# EAGLE design Xmas tree (EAGLE 9.6.2)
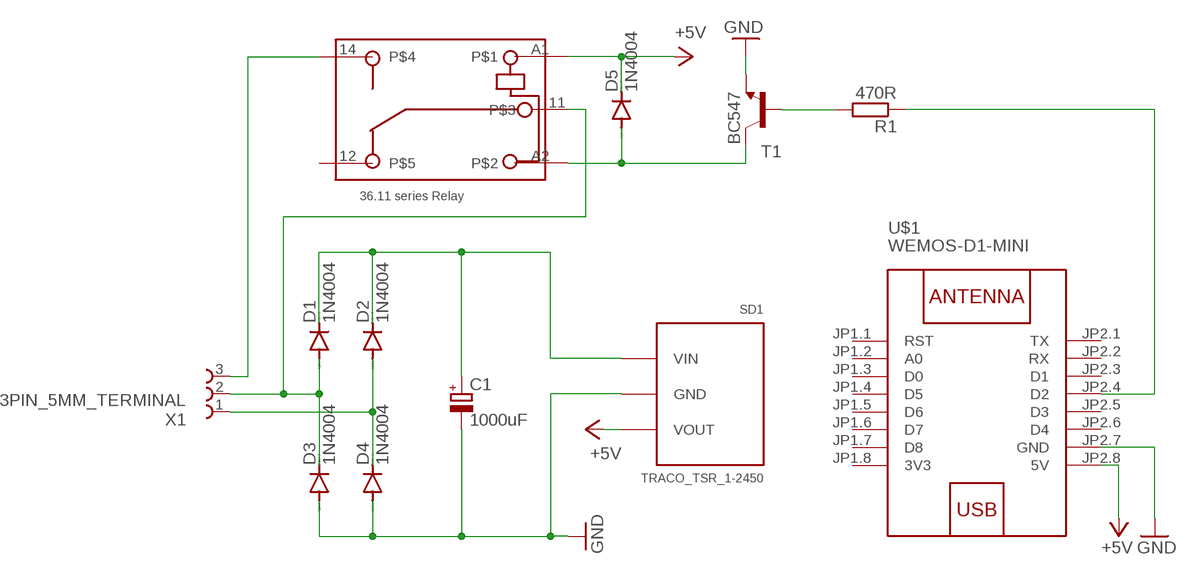
[diagram p0: schematic, sheet 1]

## Parts
C1  1000uF  CPOL-EUE3.5-10  [E3,5-10]
D1  1N4004  [DO41-10]
D2  1N4004  [DO41-10]
D3  1N4004  [DO41-10]
D4  1N4004  [DO41-10]
D5  1N4004  [DO41-10]
R1  470R  R-EU_0207/10  [0207/10]
RL1  36.11  [36.11]
SD1  TRACO_TSR_1-2450  [TRACO_TSR_1-2450]
T1  BC547  BC547-NPN-TO92-CBE  [TO92-CBE]
U$1  WEMOS-D1-MINI  [WEMOS-D1-MINI]
X1  3PIN_5MM_TERMINAL  [3PIN_5MM_TERMINAL]

## Nets
12VDC: C1.+ D1.C D2.C SD1.VIN
+5V: D5.C RL1.A1 SD1.VOUT U$1.JP2.8(5V)
+12VAC: D1.A D3.C RL1.11 X1.2
-12VAC: D2.A D4.C X1.1
GND: C1.- D3.A D4.A SD1.GND T1.E U$1.JP2.7(GND)
N$4: R1.2 T1.B
N$5: D5.A RL1.A2 T1.C
N$6: R1.1 U$1.JP2.4(D2)
OUTPUT: RL1.14 X1.3
Unconnected: RL1.12 U$1.JP1.1(RST) U$1.JP1.2(A0) U$1.JP1.3(D0) U$1.JP1.4(D5) U$1.JP1.5(D6) U$1.JP1.6(D7) U$1.JP1.7(D8) U$1.JP2.1(TX) U$1.JP2.2(RX) U$1.JP2.3(D1) U$1.JP2.5(D3) U$1.JP2.6(D4)

## Power pins joined to a net without a drawn wire
3V3: U$1.JP1.8(3V3)

## Library data of the parts
C1 = resistor:CPOL-EU: POLARIZED CAPACITOR, European symbol
D1-D5 = diode:1N4004: DIODE general purpose rectifier, 1 A
R1 = resistor:R-EU_: RESISTOR, European symbol
RL1 = Rele_Finder:36.11: Printed circuit mount miniature 10 A relay one pole changeover contacts Conform RoHS
SD1 = Voltage:TRACO_TSR_1-2450
T1 = transistor:*-NPN-: NPN Transistror BF959 corrected 2008.03.06
U$1 = Sbirka modulu:WEMOS-D1-MINI: WEMOS D1 mini: Mini Wi-Fi Board based on ESP-8266 device More details can be found here: https://www.wemos.cc/product/d1-mini.html Click here to find device on ebay.com <http://www.ebay.com/sch/wemos+d1+mini+nodemcu>
X1 = Terminaly:3PIN_5MM_TERMINAL

## Board
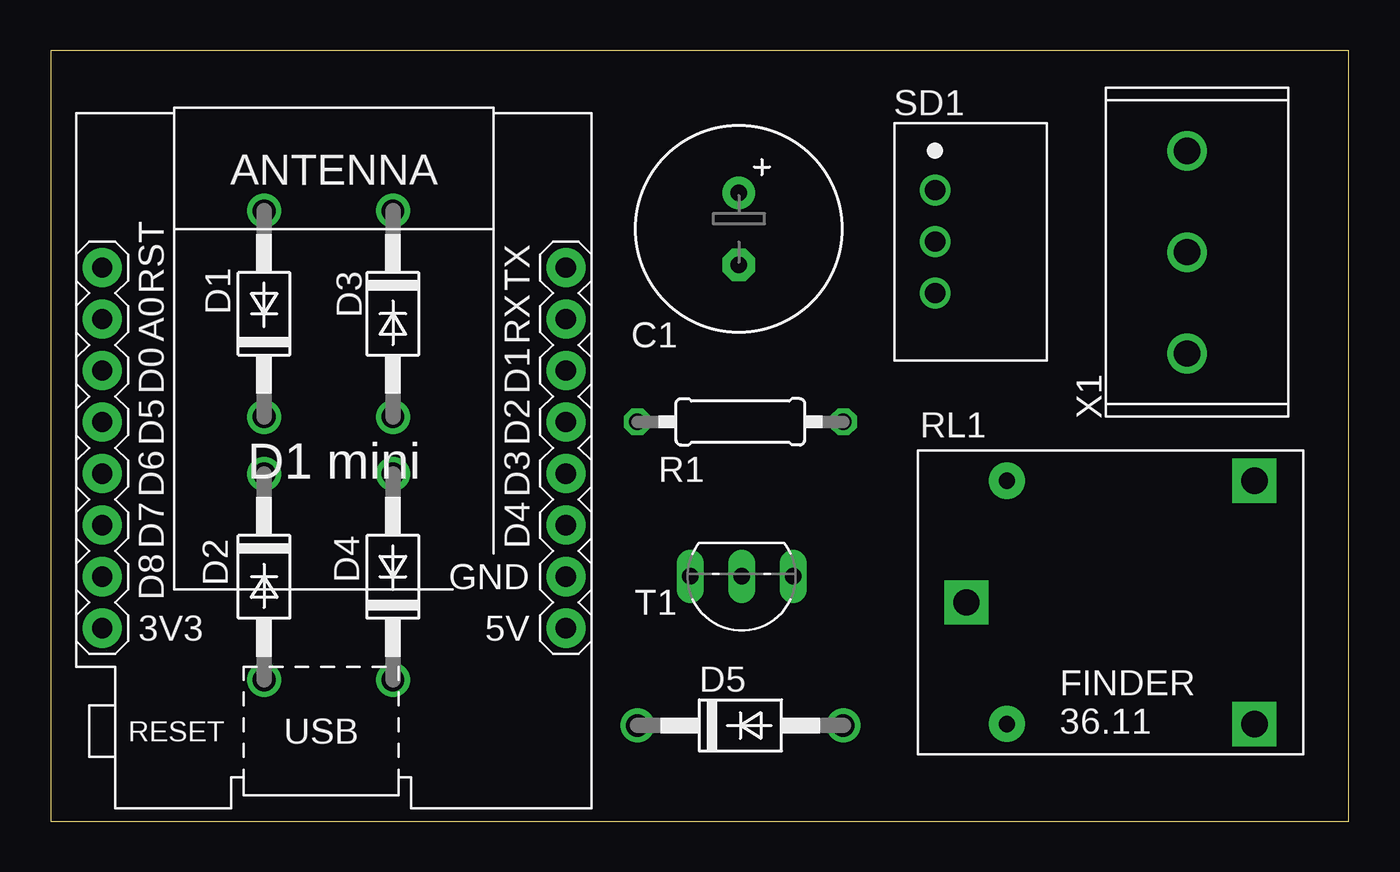
[diagram p1: board, top side]
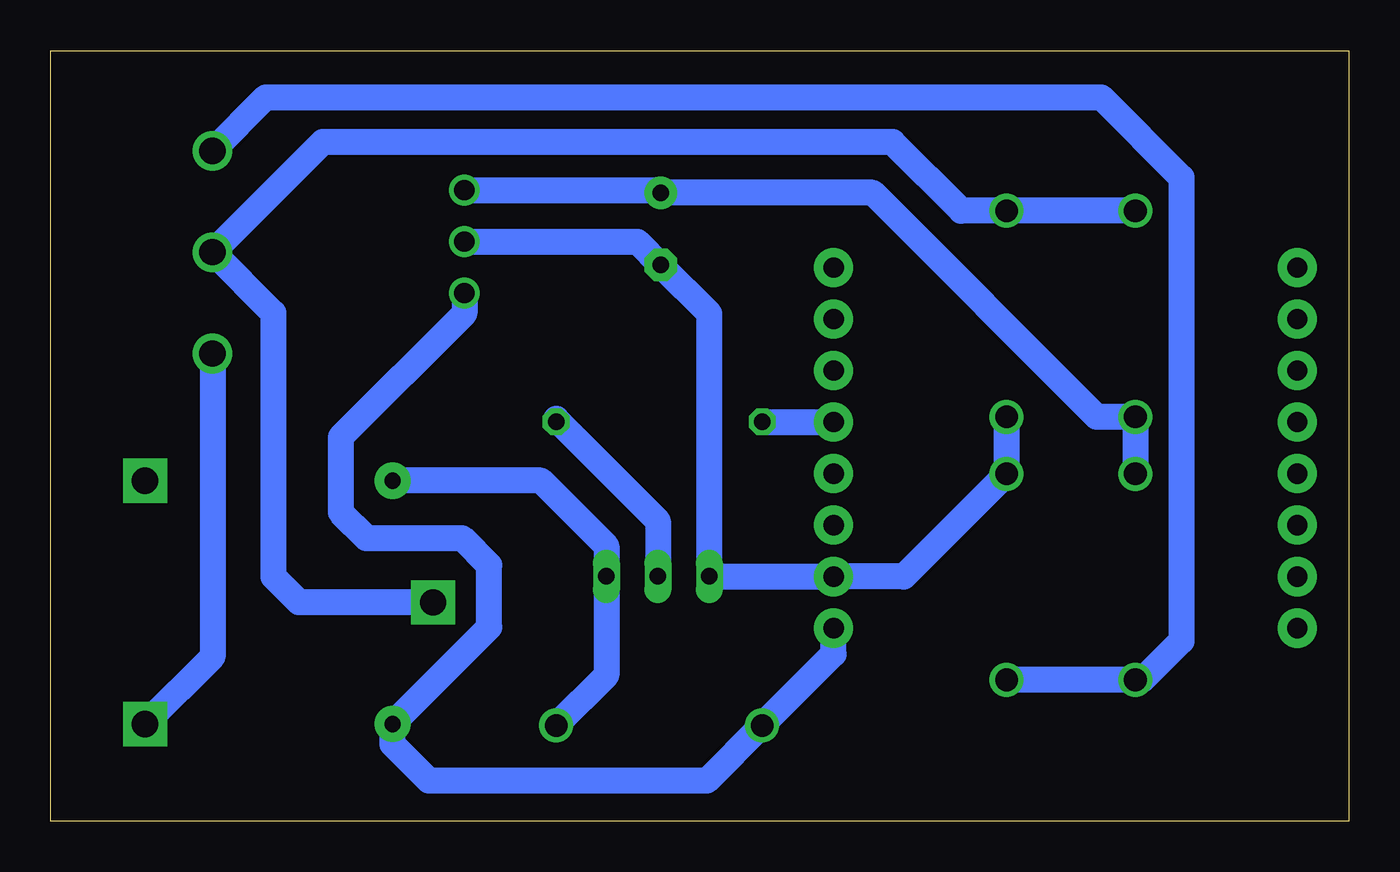
[diagram p2: board, bottom side, seen from below]

Size 64 x 38 mm. Coordinates in mm from the lower left corner, seen from the top.
Outline: 0,0 64,0 64,38 0,38 0,0
Copper layers (1*16): Top 0.035mm / dielectric 1.5mm / Bottom 0.035mm
Design rules "default": minimum track width 6mil, minimum drill 0.35mm, track to track 6mil, track to pad 6mil, pad to pad 6mil, via to via 6mil, smd to smd 6mil, copper to edge 40mil, drill to drill 6mil, minimum pad ring 10mil, minimum via ring 8mil, stop-mask expansion 4mil, vias tented up to drill 0mil, thermal gap 10mil

### Footprints (pad centres in the part's own frame; a part is rotated, then mirrored left to right if it is on the bottom)
E3,5-10 = drill 0.813 pad 1.6: + -1.778,0 | drill 0.813 pad 1.6 octagon: - 1.778,0
DO41-10 = drill 1.118: A 5.08,0; C -5.08,0
0207/10 = drill 0.813 octagon: 1 -5.08,0; 2 5.08,0
36.11 = drill 1.3 pad 2.184 square: 11 -7.1,0; 12 7.1,6; 14 7.1,-6 | drill 0.8 pad 1.778: A1 -5.1,-6; A2 -5.1,6
TRACO_TSR_1-2450 = drill 1: GND -0.01,-1.75; VIN -2.55,-1.75; VOUT 2.53,-1.75
TO92-CBE = drill 0.813 long: B 0,0; C -2.54,0; E 2.54,0
WEMOS-D1-MINI = drill 1 pad 1.93: JP1.1 -11.43,9.525; JP1.2 -11.43,6.985; JP1.3 -11.43,4.445; JP1.4 -11.43,1.905; JP1.5 -11.43,-0.635; JP1.6 -11.43,-3.175; JP1.7 -11.43,-5.715; JP1.8 -11.43,-8.255; JP2.1 11.43,9.525; JP2.2 11.43,6.985; JP2.3 11.43,4.445; JP2.4 11.43,1.905; JP2.5 11.43,-0.635; JP2.6 11.43,-3.175; JP2.7 11.43,-5.715; JP2.8 11.43,-8.255
3PIN_5MM_TERMINAL = drill 1.3: 1 -5,0; 2 0,0; 3 5,0

### Placement (x,y rotation side)
C1  33.92,29.21 270 top
D1  10.52,25.02 90 top
D2  10.52,12.05 270 top
D3  16.87,25.02 270 top
D4  16.87,12.05 90 top
D5  34,4.72 0 top
R1  34,19.7 0 top
RL1  52.24,10.79 0 top
SD1  45.35,28.57 270 top
T1  34.06,12.07 180 top
U$1  13.97,17.78 0 top
X1  56.02,28.07 270 top

### Tracks (layer width: path | path; a pad name or v marks a point on that pad's centre or on a via)
12VDC
  Bottom 1.27: D2.C D1.C 12.43,19.95 23.47,30.99 C1.+ 34.06,31.12 SD1.VIN
+5V
  Bottom 1.27: SD1.VOUT 43.6,25.05 49.7,18.95 49.7,15.24 48.44,13.97 43.72,13.97 42.38,12.62 42.38,9.56 RL1.A1 47.15,3.79 45.35,2 31.64,2 D5.C 25.4,8.24 U$1.JP2.8
+12VAC
  Bottom 1.27: RL1.11 51.76,10.79 53.02,12.06 53.02,25.07 X1.2 50.59,33.5 22.5,33.5 19.11,30.11 D3.C D1.A
-12VAC
  Bottom 1.27: D4.C D2.A 10.17,6.97 8.26,8.89 8.26,31.75 12.2,35.7 53.4,35.7 X1.1
GND
  Bottom 1.27: D3.A D4.A 21.94,12.06 U$1.JP2.7 T1.E 31.52,25.03 C1.- 35.08,28.59 SD1.GND
N$4
  Bottom 1.27: R1.2 39.08,19.84 34.06,14.8 T1.B
N$5
  Bottom 1.27: D5.A 36.6,7.2 36.6,13.57 39.83,16.8 RL1.A2
N$6
  Bottom 0.152: U$1.JP2.4 25.5,19.68 25.52,19.7
  Bottom 1.27: R1.1 25.52,19.7
OUTPUT
  Bottom 1.27: X1.3 56.02,8.12 RL1.14